# Altium schematic sheet rfıd door lock.SchDoc
size A4
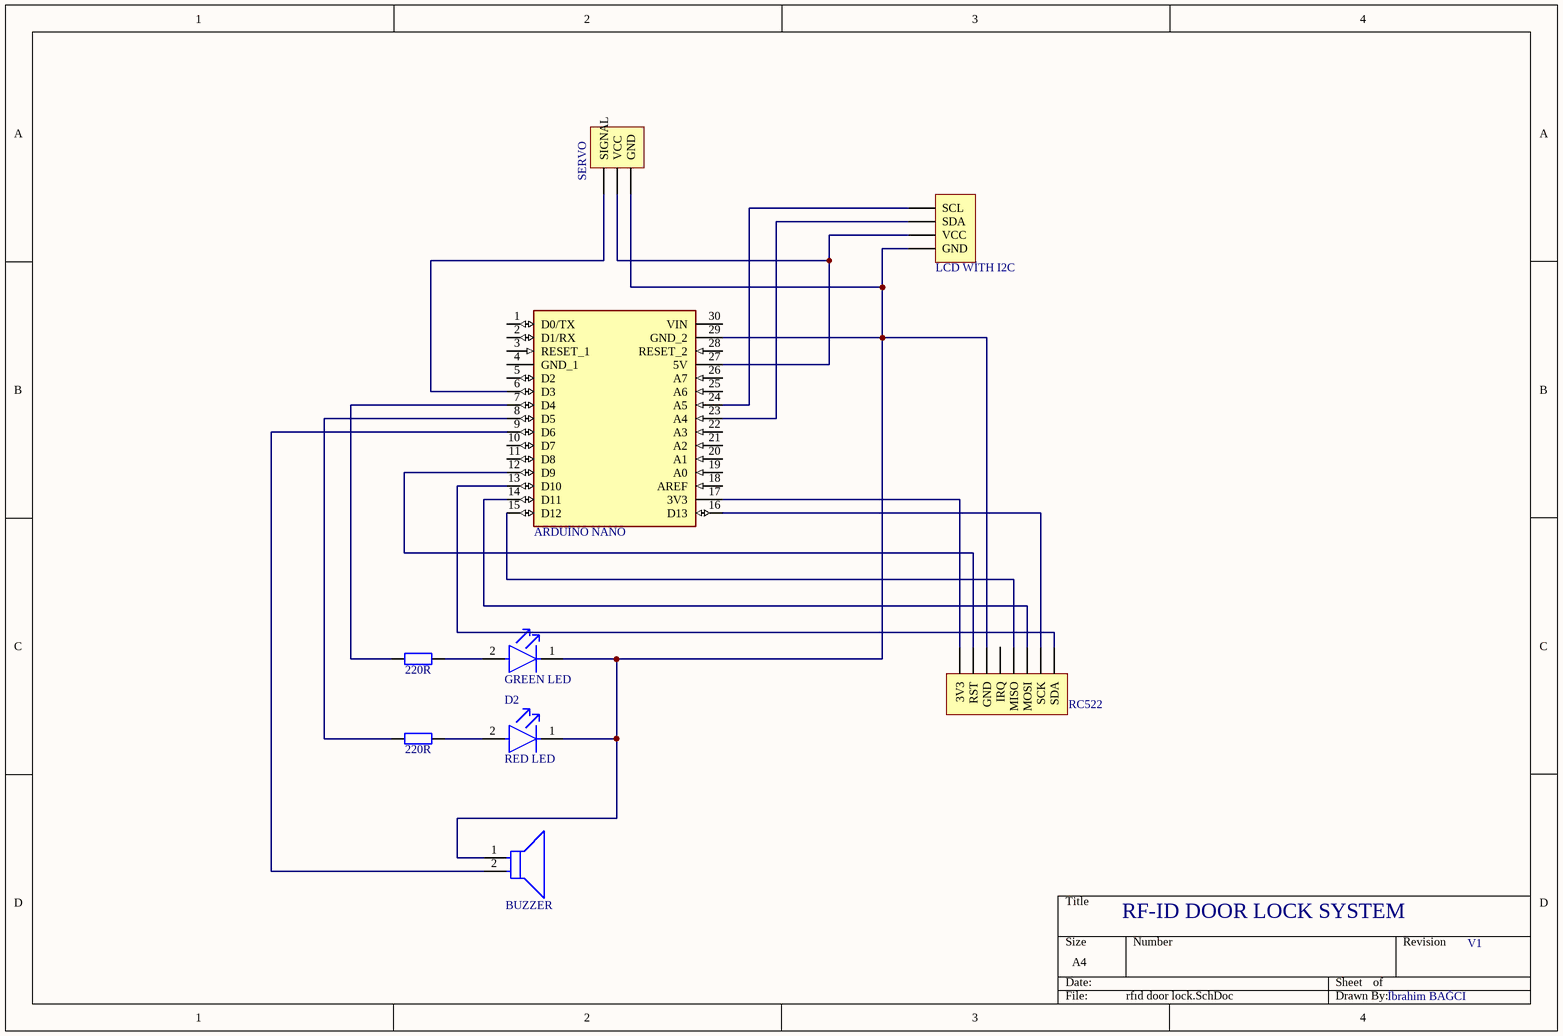
[diagram p0: rfıd door lock.SchDoc]

## Parts
D1  GREEN LED  [FP-HLMP-1503-MFG]
D2  RED LED  [FP-HLMP-1301-MFG]
LS1  BUZZER  [FP-MCKPX-G1203A-K4056-MFG]
P1  SERVO  [HDR1X3]
P2  LCD WİTH I2C  [HDR1X4]
P3  RC522  [HDR1X8]
R1  220R  [AXIAL-0.4]
R2  220R  [AXIAL-0.4]
U1  ARDUİNO NANO  [MODULE_A000005]

## Nets
NetD1_1: D1.1(C) D2.1(C) LS1.1(C) P1.3(GND) P2.4(GND) P3.6(GND) U1.29(GND_2)
NetD1_2: D1.2(A) R1.2
NetD2_2: D2.2(A) R2.2
NetLS1_2: LS1.2(A) U1.9(D6)
NetP1_1: P1.1(SIGNAL) U1.6(D3)
NetP1_2: P1.2(VCC) P2.3(VCC) U1.27(5V)
NetP2_1: P2.1(SCL) U1.24(A5)
NetP2_2: P2.2(SDA) U1.23(A4)
NetP3_1: P3.1(SDA) U1.13(D10)
NetP3_2: P3.2(SCK) U1.16(D13)
NetP3_3: P3.3(MOSI) U1.14(D11)
NetP3_4: P3.4(MISO) U1.15(D12)
NetP3_7: P3.7(RST) U1.12(D9)
NetP3_8: P3.8(3V3) U1.17(3V3)
NetR1_1: R1.1 U1.7(D4)
NetR2_1: R2.1 U1.8(D5)

Not connected (* = marked no-connect by the designer): P3 5(IRQ); U1 1(D0/TX) 2(D1/RX) 3(RESET_1) 4(GND_1) 5(D2) 10(D7) 11(D8) 18(AREF) 19(A0) 20(A1) 21(A2) 22(A3) 25(A6) 26(A7) 28(RESET_2) 30(VIN)

## Notes on the sheet
- RF-ID DOOR LOCK SYSTEM
- V1
- İbrahim BAĞCI

## Library data of the parts
D1 = CMP-18399-000010-1: LED GREEN DIFFUSED T-1 T/H; Manufacturer: Broadcom; Reverse Voltage: 5V; Wavelength: 569nm; Forward Voltage: 2.1V; Led Orientation: Straight; Viewing Angle: 60°; Max Junction Temp: +110°C; Peak Emmision Wavelength: 565nm; Luminous Intensity: 1mcd; Standoff Height: 0.88mm; Forward Current: 10mA; Mouser Description: LED; Green; 1mcd; 0.115In.Dia.; T-1; 565nm; 25mA; 2.1V; 5V; GaP; -20degC; 100deg; ComponentLink2Description: Datasheet; Digikey Description: LED GREEN DIFFUSED T-1 T/H; Device Class L1: Optoelectronics; Device Class L3: unset; Automotive: No; Device Class L2: LEDs; Manufacturer Part Number: HLMP-1503; Category: Diode; Temperature Range Low: -20°C; Height: 6.35mm; RoHS: TRUE; Octopart: https://octopart.com/hlmp-1503-broadcom-71130371; Temperature: -20°C to +100°C; Lead Free: Yes; ComponentLink2URL: https://docs.broadcom.com/docs/AV02-1555EN; Package: HLMP-1503; Colour: Green; Temperature Range High: +100°C
D2 = CMP-18399-000007-1: LED RED DIFFUSED T-1 T/H; Manufacturer: Broadcom; Forward Current: 10mA; Max Junction Temp: +110°C; Wavelength: 626nm; Led Orientation: Straight; Viewing Angle: 60°; Description: LED Uni-Color Red 635nm 2-Pin T-1; Luminous Intensity: 3.4mcd; Forward Voltage: 1.9V; Reverse Voltage: 5V; Peak Emmision Wavelength: 635nm; Mouser Description: Standard LEDs - Through Hole Red Diffused 635nm 3.4mcd; RoHS: TRUE; ComponentLink2Description: Datasheet; Device Class L1: Optoelectronics; Temperature Range High: +100°C; Manufacturer Part Number: HLMP-1301; ComponentLink2URL: https://docs.broadcom.com/docs/AV02-1555EN; Colour: Red; Digikey Description: LED RED DIFFUSED T-1 T/H; Automotive: No; Device Class L2: LEDs; Temperature Range Low: -40°C; Octopart: https://octopart.com/hlmp-1301-broadcom-71130345; Category: Diode; Lead Free: Yes; Device Class L3: unset; Package: 0; Temperature: -40°C to +100°C
LS1 = CMP-12433-000001-1: MAGNETIC BUZZER AND TRANSDUCER - More Details; Manufacturer Part Number: MCKPX-G1203A-K4056; Manufacturer: Multicomp Pro; Operating Supply Voltage: 3V; Current: 30mA; Frequency: 2300Hz; Max Supply Voltage: 5V; Min Supply Voltage: 2V; Standoff Height: 0.5mm; ComponentLink2Description: Datasheet; ComponentLink2URL: http://www.farnell.com/datasheets/1498149.pdf?_ga=2.17855225.1157923166.1572356775-536200964.1569240579; Temperature Range High: +70°C; Device Class L2: Audio Products; Temperature Range Low: -20°C; Package: 0; Temperature: -20°C to +70°C; Category: Speak; Octopart: https://octopart.com/mckpx-g1203a-k4056-multicomp-12157154; RoHS: TRUE; Lead Free: Yes; Height: 9.5mm; Device Class L1: Electromechanical; Automotive: No; Device Class L3: Buzzers
P1 = Header 3: Header, 3-Pin; LatestRevisionDate: 17-Jul-2002; LatestRevisionNote: Re-released for DXP Platform.; Publisher: Altium Limited
P2 = Header 4: Header, 4-Pin; LatestRevisionDate: 17-Jul-2002; LatestRevisionNote: Re-released for DXP Platform.; Publisher: Altium Limited
P3 = Header 8: Header, 8-Pin; LatestRevisionDate: 17-Jul-2002; LatestRevisionNote: Re-released for DXP Platform.; Publisher: Altium Limited
R1 R2 = Res2: Resistor; Value: 1K; Published: 8-Jun-2000; LatestRevisionDate: 17-Jul-2002; LatestRevisionNote: Re-released for DXP Platform.; PackageReference: AXIAL-0.4; Publisher: Altium Limited; PackageDescription: Axial Device, Thru-Hole; 2 Leads; 0.4 in Pin Spacing
U1 = A000005: CLOCK SAW OSCILLATOR SEAM7050 T&; Value: *; MP: A000005; Package: None; Availability: Unavailable; Price: None